# Altium project bluebox-micro-1B.PrjPCB
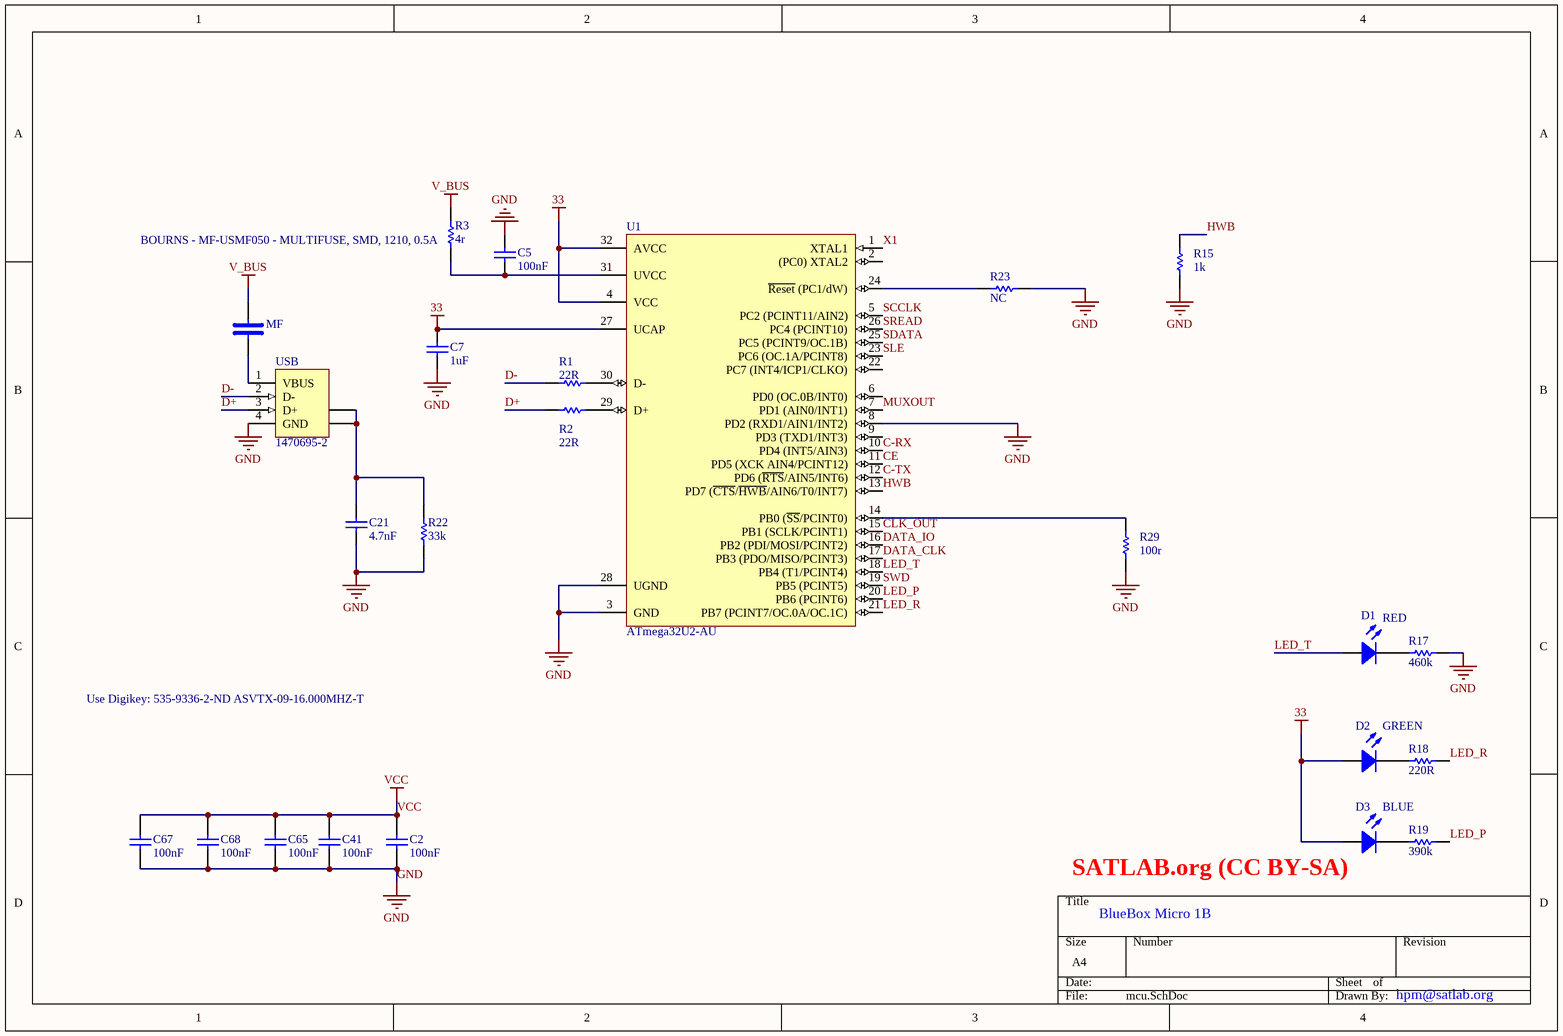
[diagram p0: mcu.SchDoc]
3 sheets, 94 parts. Net scope: global (net labels, ports and power ports of the same name join across sheets).
Board file: bluebox-micro-1B.PcbDoc
Sheets:
  mcu.SchDoc
  transceiver.SchDoc
  misc_rf.SchDoc

## Sheet mcu.SchDoc
size A4

### Parts
C2  value 100nF  [C06]  (hidden comment: Capacitor)
C5  value 100nF  [C06]  (hidden comment: Cap Semi)
C7  value 1uF  [C06]  (hidden comment: Cap Semi)
C21  value 4.7nF  [C06]  (hidden comment: Cap Semi)
C41  value 100nF  [C04]  (hidden comment: Capacitor)
C65  value 100nF  [C04]  (hidden comment: Capacitor)
C67  value 100nF  [C06]  (hidden comment: Capacitor)
C68  value 100nF  [C06]  (hidden comment: Capacitor)
D1  RED  [L06]
D2  GREEN  [L06]
D3  BLUE  [L06]
MF  CapacitorBig  [C1210]  (value not drawn)
R1  value 22R  [R06]  (hidden comment: Resistor)
R2  value 22R  [R06]  (hidden comment: Resistor)
R3  value 4r  [R06]  (hidden comment: Resistor)
R15  value 1k  [R06]  (hidden comment: Resistor)
R17  value 460k  [R06]  (hidden comment: Resistor)
R18  value 220R  [R06]  (hidden comment: Resistor)
R19  value 390k  [R06]  (hidden comment: Resistor)
R22  value 33k  [R06]  (hidden comment: Resistor)
R23  value NC  [R06]  (hidden comment: Resistor)
R29  value 100r  [R06]  (hidden comment: Resistor)
U1  ATmega32U2-AU  [32A_L]
USB  1470695-2  [1470695A]

### Nets
GND: C2.1 C5.1 C7.2 C21.2 C41.2 C65.2 C67.1 C68.1 R15.1 R17.1 R22.2 R23.1 R29.1 U1.3(GND) U1.8(PD2_(RXD1/AIN1/INT2)) U1.28(UGND) USB.4(GND)
V_BUS: MF.1 R3.1
VCC: C2.2 C7.1 C41.1 C65.1 C67.2 C68.2 D2.1(A) D3.1(A) U1.4(VCC) U1.27(UCAP) U1.32(AVCC)  [also labelled 33]
C-RX: U1.10(PD4_(INT5/AIN3))
C-TX: U1.12(PD6_(~{RTS}/AIN5/INT6))
CE: U1.11(PD5_(XCK_AIN4/PCINT12))
CLK_OUT: U1.15(PB1_(SCLK/PCINT1))
D+: R2.1 USB.3(D+)
D-: R1.2 USB.2(D-)
DATA_CLK: U1.17(PB3_(PDO/MISO/PCINT3))
DATA_IO: U1.16(PB2_(PDI/MOSI/PCINT2))
HWB: R15.2 U1.13(PD7_(~{CTS}/~{HWB}/AIN6/T0/INT7))
LED_P: R19.1 U1.20(PB6_(PCINT6))
LED_R: R18.1 U1.21(PB7_(PCINT7/OC.0A/OC.1C))
LED_T: D1.1(A) U1.18(PB4_(T1/PCINT4))
MUXOUT: U1.7(PD1_(AIN0/INT1))
SCCLK: U1.5(PC2_(PCINT11/AIN2))
SDATA: U1.25(PC5_(PCINT9/OC.1B))
SLE: U1.23(PC6_(OC.1A/PCINT8))
SREAD: U1.26(PC4_(PCINT10))
SWD: U1.19(PB5_(PCINT5))
X1: U1.1(XTAL1)
NetC5_2: C5.2 R3.2 U1.31(UVCC)
NetC21_1: C21.1 R22.1 USB.5(SHLD) USB.6(SHLD)
NetD1_2: D1.2(K) R17.2
NetD2_2: D2.2(K) R18.2
NetD3_2: D3.2(K) R19.2
NetMF_2: MF.2 USB.1(VBUS)
NetR1_1: R1.1 U1.30(D-)
NetR2_2: R2.2 U1.29(D+)
NetR23_2: R23.2 U1.24(~{Reset}_(PC1/dW))
NetR29_2: R29.2 U1.14(PB0_(~{SS}/PCINT0))

Not connected (* = marked no-connect by the designer): U1 2((PC0)_XTAL2) 6(PD0_(OC.0B/INT0)) 9(PD3_(TXD1/INT3)) 22(PC7_(INT4/ICP1/CLKO))

### Notes on the sheet
- (near R3) BOURNS - MF-USMF050 - MULTIFUSE, SMD, 1210, 0.5A
- Use Digikey: 535-9336-2-ND ASVTX-09-16.000MHZ-T
- (near D3) SATLAB.org (CC BY-SA)
- BlueBox Micro 1B
- hpm@satlab.org

### Library data of the parts
C2 C41 C65 C67 C68 = Capacitor: Capacitor, standard
C5 C7 C21 = Cap Semi: Capacitor (Semiconductor SIM Model); Published: 8-Jun-2000; LatestRevisionDate: 29-May-2009; LatestRevisionNote: IPC-7351 Footprint Added.; PackageReference: C1206; Publisher: Altium Limited; PackageDescription: Chip Capacitor
D1-D3 = LED: Typical RED GaAs LED; Published: 8-Jun-2000; LatestRevisionDate: 08-Jul-2005; LatestRevisionNote: Mech Layer 1 removed.; PackageReference: LED-1; Publisher: Altium Limited
MF = CapacitorBig: Capacitor for PRU etc.; By: Troels Jessen; Username: tjessen; Datasheet: http://search.murata.co.jp/Ceramy/image/img/w_hinm/L0005E.pdf; DigiKey: 490-5314-1-ND
R1-R3 R15 R17-R19 R22 R23 R29 = Resistor: By: Troels Jessen; Username: tjessen
U1 = ATmega32U2-AU: 8-bit AVR Microcontroller, 2.7-5.5V, 32KB Flash, 1KB EEPROM, 1KB SRAM, 32-pin TQFP, Industrial Grade (-40°C to 85°C); DatasheetVersion: revD, Nov-2010; PackageVersion: revC, Oct-2010; PackageReference: 32A; PackageDescription: 32-Lead, 7x7x1.0 mm Body, 0.8mm Lead Pitch, Thin Profile Plastic Quad Flat Package (TQFP); Code_JEDEC: MS-026-ABA; ComponentLink1Description: Manufacturer URL; ComponentLink1URL: http://www.atmel.com/; ComponentLink2Description: ATmega8U2/16U2/32U2 Datasheet; ComponentLink2URL: http://www.atmel.com/dyn/resources/prod_documents/doc7799.pdf; ComponentLink3Description: ATmega8U2/16U2/32U2 Summary; ComponentLink3URL: http://www.atmel.com/dyn/resources/prod_documents/7799S.pdf
USB = 1470695-2: USB 1.1, Right Angle, SMT, A Type, Plug, 4 Position, Natural; ContactMaterial: Brass; ContactPlating: Gold (30) over Nickel (50); PCB_Layout: Complies with manufacturer's recommendation.; DrillSize: Corresponds to nominal value.; PanelGround: Without; Published: 15-Jul-2004; DatasheetDocument: 21-Jan-2003; PackageDocument: 21-Jan-2003; PackageReference: 1470695A; Publisher: Altium Limited; HousingMaterial: Thermoplastic; ComponentLink1Description: Manufacturer Link; ComponentLink1URL: http://www.tycoelectronics.com/; ComponentLink2Description: Packaging Specification; ComponentLink2URL: http://ecommas.tycoelectronics.com/commerce/DocumentDelivery/DDEController?Action=showdoc&DocId=Customer+Drawing%7F1470695%7FO%7Fpdf%7FEnglish%7FC_1470695_O.pdf

## Sheet transceiver.SchDoc
size A3
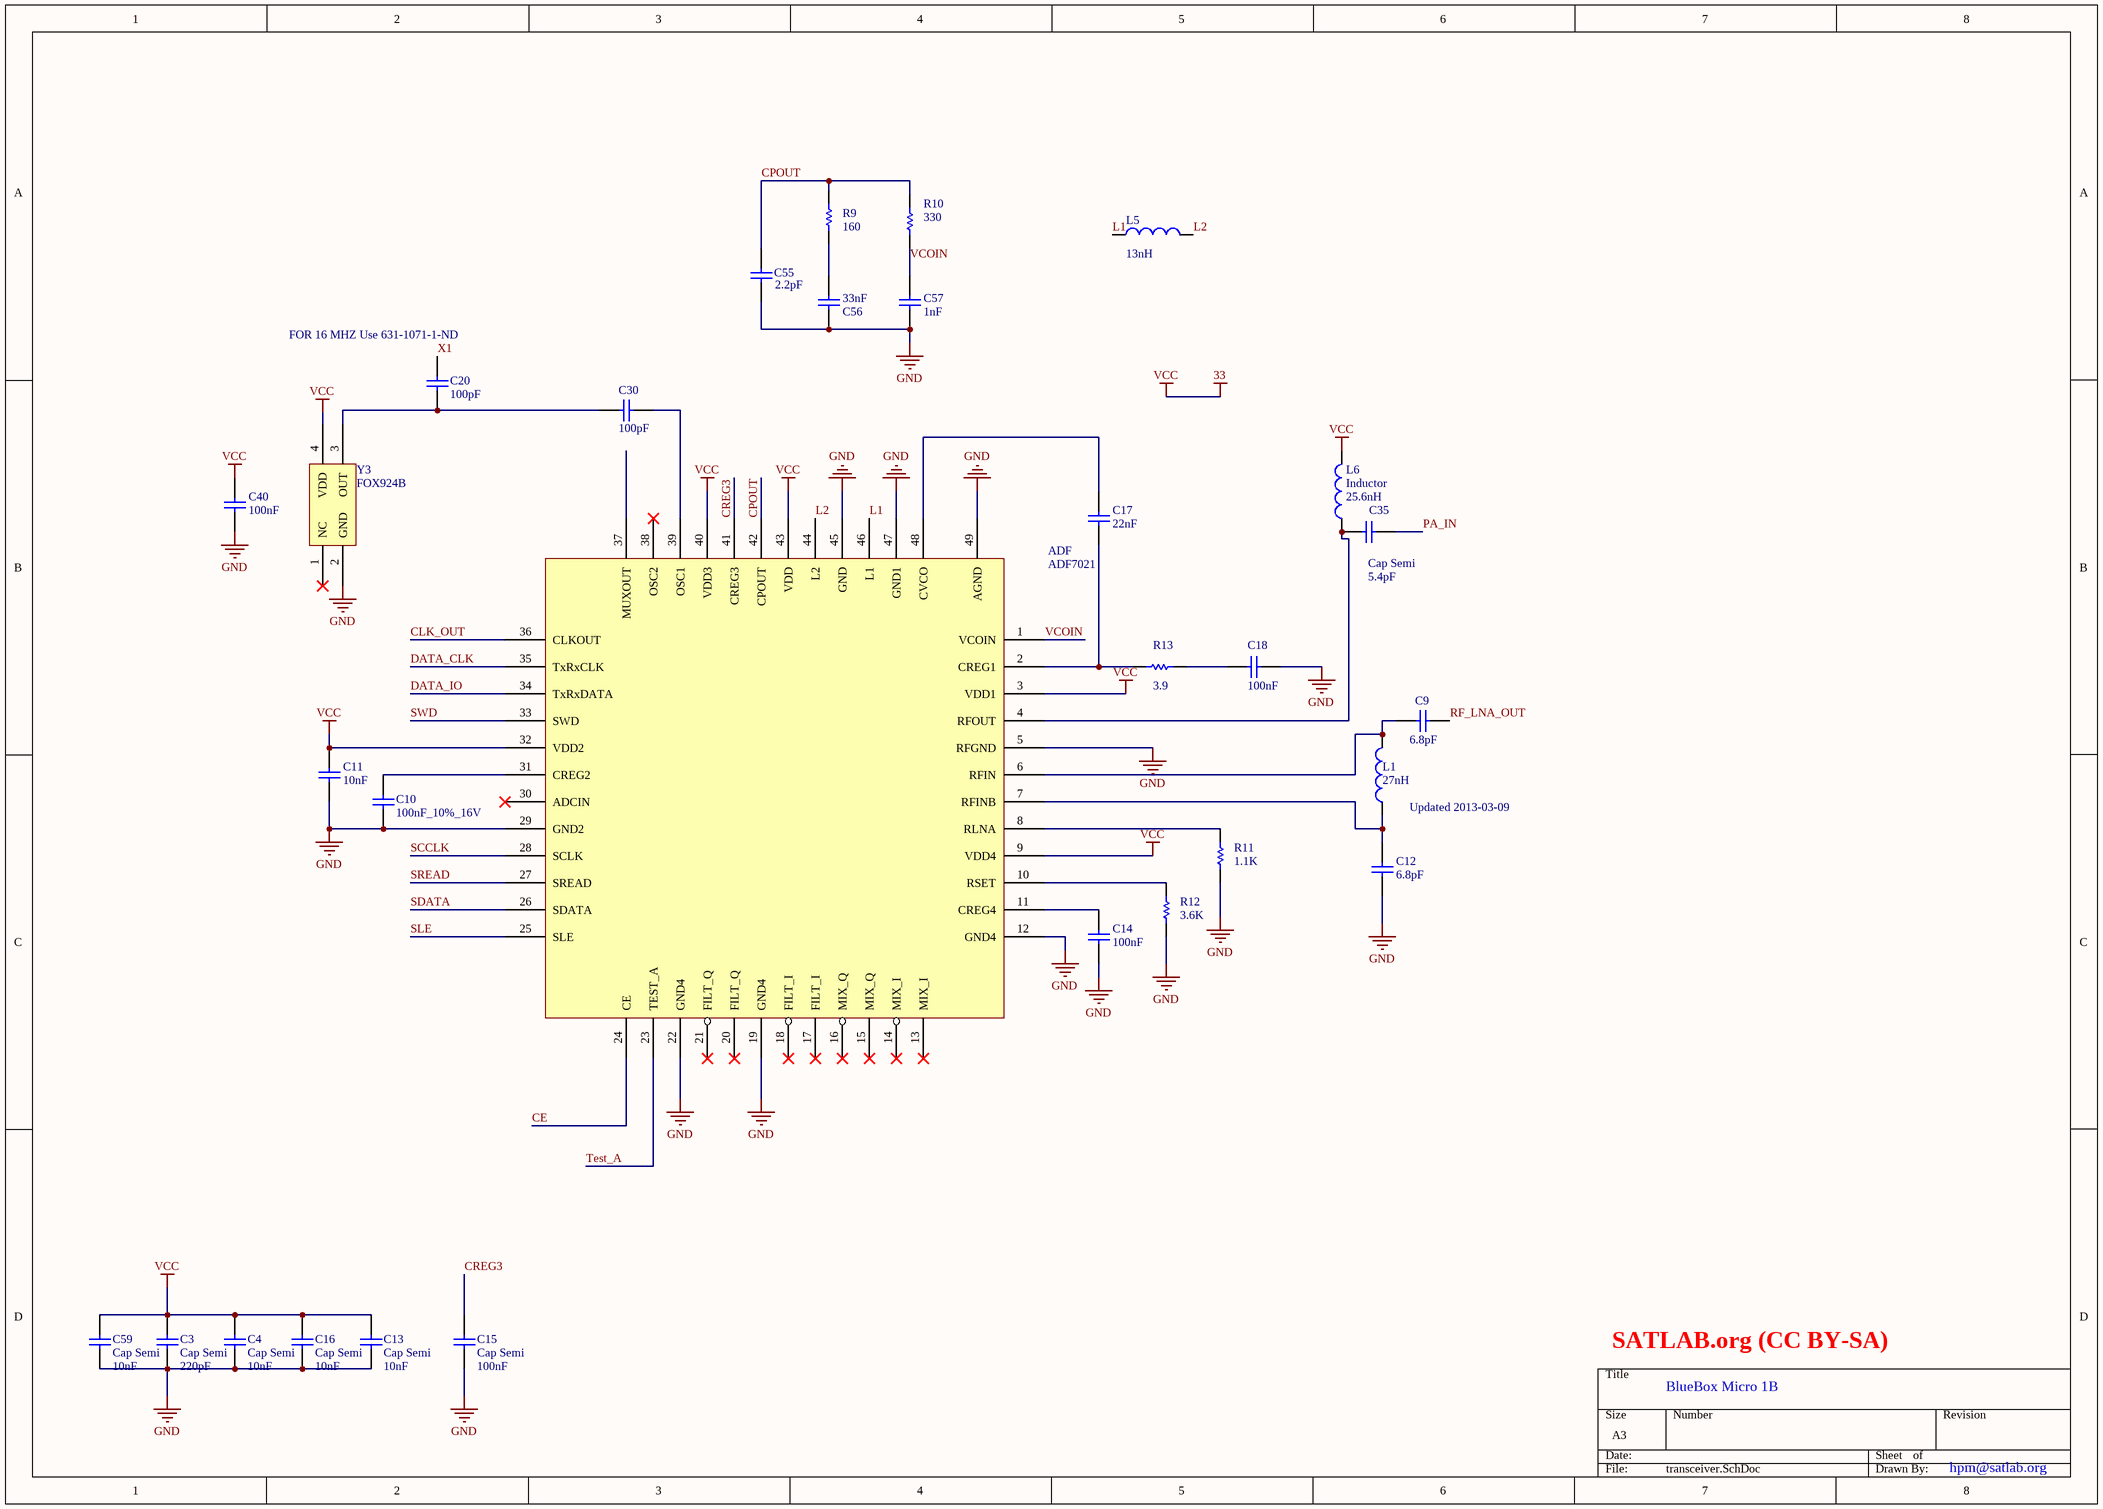
[diagram p1: transceiver.SchDoc]

### Parts
ADF  ADF7021  [QFN50P700X700X100-48M]
C3  Cap Semi  value 220pF  [C06]
C4  Cap Semi  value 10nF  [C06]
C9  value 6.8pF  [C06]  (hidden comment: Cap Semi)
C10  value 100nF_10%_16V  [C04]  (hidden comment: Capacitor)
C11  value 10nF  [C06]  (hidden comment: Cap Semi)
C12  value 6.8pF  [C06]  (hidden comment: Cap Semi)
C13  Cap Semi  value 10nF  [C06]
C14  value 100nF  [C06]  (hidden comment: Cap Semi)
C15  Cap Semi  value 100nF  [C06]
C16  Cap Semi  value 10nF  [C06]
C17  value 22nF  [C06]  (hidden comment: Cap Semi)
C18  value 100nF  [C06]  (hidden comment: Cap Semi)
C20  value 100pF  [C04]  (hidden comment: Capacitor)
C30  value 100pF  [C04]  (hidden comment: Capacitor)
C35  Cap Semi  value 5.4pF  [C06]
C40  value 100nF  [C06]  (hidden comment: Cap Semi)
C55  value 2.2pF  [C06]  (hidden comment: Cap Semi)
C56  value 33nF  [C06]  (hidden comment: Cap Semi)
C57  value 1nF  [C06]  (hidden comment: Cap Semi)
C59  Cap Semi  value 10nF  [C06]
L1  value 27nH  [C06]  (hidden comment: Inductor)
L5  value 13nH  [L06]  (hidden comment: Inductor)
L6  Inductor  value 25.6nH  [C06]
R9  value 160  [R06]  (hidden comment: Res Semi)
R10  value 330  [R06]  (hidden comment: Res Semi)
R11  value 1.1K  [R06]  (hidden comment: Res Semi)
R12  value 3.6K  [R06]  (hidden comment: Res Semi)
R13  value 3.9  [R06]  (hidden comment: Res Semi)
Y3  FOX924B  [Fox924]

### Nets
GND: ADF.5(RFGND) ADF.12(GND4) ADF.19(GND4) ADF.22(GND4) ADF.29(GND2) ADF.45(GND) ADF.47(GND1) ADF.49(AGND) C3.1 C4.1 C10.1 C11.1 C12.1 C13.1 C14.1 C15.1 C16.1 C18.2 C40.1 C55.1 C56.1 C57.1 C59.1 R11.2 R12.1 Y3.2(GND)
VCC: ADF.3(VDD1) ADF.9(VDD4) ADF.32(VDD2) ADF.40(VDD3) ADF.43(VDD) C3.2 C4.2 C11.2 C13.2 C16.2 C40.2 C59.2 L6.2 Y3.4(VDD)  [also labelled 33]
CE: ADF.24(CE)
CLK_OUT: ADF.36(CLKOUT)
CPOUT: ADF.42(CPOUT) C55.2 R9.2 R10.2
CREG3: ADF.41(CREG3) C15.2
DATA_CLK: ADF.35(TxRxCLK)
DATA_IO: ADF.34(TxRxDATA)
L1: ADF.46(L1) L5.1
L2: ADF.44(L2) L5.2
PA_IN: C35.2
RF_LNA_OUT: C9.1
SCCLK: ADF.28(SCLK)
SDATA: ADF.26(SDATA)
SLE: ADF.25(SLE)
SREAD: ADF.27(SREAD)
SWD: ADF.33(SWD)
Test_A: ADF.23(TEST_A)
VCOIN: ADF.1(VCOIN) C57.2 R10.1
X1: C20.1
NetADF_2: ADF.2(CREG1) C17.1 R13.1
NetADF_4: ADF.4(RFOUT) C35.1 L6.1
NetADF_6: ADF.6(RFIN) C9.2 L1.2
NetADF_7: ADF.7(RFINB) C12.2 L1.1
NetADF_8: ADF.8(RLNA) R11.1
NetADF_10: ADF.10(RSET) R12.2
NetADF_11: ADF.11(CREG4) C14.2
NetADF_31: ADF.31(CREG2) C10.2
NetADF_39: ADF.39(OSC1) C30.1
NetADF_48: ADF.48(CVCO) C17.2
NetC18_1: C18.1 R13.2
NetC20_2: C20.2 C30.2 Y3.3(OUT)
NetC56_2: C56.2 R9.1

Not connected (* = marked no-connect by the designer): ADF 13(MIX_I)* 14(MIX_I)* 15(MIX_Q)* 16(MIX_Q)* 17(FILT_I)* 18(FILT_I)* 20(FILT_Q)* 21(FILT_Q)* 30(ADCIN)* 37(MUXOUT) 38(OSC2)*; Y3 1(NC)*

### Notes on the sheet
- Using http://www.calculatoredge.com/electronics/ch%20pi%20low%20pass.htm
- (near C20) FOR 16 MHZ Use 631-1071-1-ND
- Using http://bwrc.eecs.berkeley.edu/research/rf/projects/60ghz/matching/impmatch.html
- (near L1) Updated 2013-03-09
- SATLAB.org (CC BY-SA)
- BlueBox Micro 1B
- hpm@satlab.org

### Library data of the parts
ADF = ADF7021: ADF7021 transceiver; By: Nikolaj Bisgaard Pedersen; Datasheet: http://www.analog.com/static/imported-files/data_sheets/ADF7021.pdf; Homepage: http://www.analog.com/en/rfif-components/short-range-transceivers/adf7021/products/product.html; Supplier 1: Digi-Key; Supplier Part Number 1: ADF7021BCPZ-ND
C3 C4 C9 C11-C18 C35 C40 C55-C57 C59 = Cap Semi: Capacitor (Semiconductor SIM Model); Published: 8-Jun-2000; LatestRevisionDate: 17-Jul-2002; LatestRevisionNote: Re-released for DXP Platform.; PackageReference: C1206; Publisher: Altium Limited
C10 C20 C30 = Capacitor: Capacitor, standard
L5 = Inductor: Code_IEC: 1005; Published: 8-Jun-2000; LatestRevisionDate: 29-May-2009; LatestRevisionNote: IPC-7351 Footprint Added.; PackageReference: 0402-A; Publisher: Altium Limited; PackageDescription: Chip Inductor; Code_JEITA: 0402
R9-R13 = Res Semi: Semiconductor Resistor; Published: 8-Jun-2000; LatestRevisionDate: 17-Jul-2002; LatestRevisionNote: Re-released for DXP Platform.; PackageReference: AXIAL-0.5; Publisher: Altium Limited
Y3 = FOX924B: FOX924B TCXO 19.44 MHz; By: Nikolaj B. Pedersen; Username: Markem; Datasheet: http://www.foxonline.com/pdfs/fox924.pdf; Digikey: 631-1072-1-ND; Supplier 1: Digi-Key; Supplier 2: Farnell; Supplier Part Number 1: 631-1072-1-ND; Supplier Part Number 2: 2063960
L1 L6 = Inductor: Published: 07-04-2008; LatestRevisionNote: Aalborg University; PackageReference: 0402-A; Publisher: <HP>; Digikey: 495-2017-1-ND

## Sheet misc_rf.SchDoc
size A4
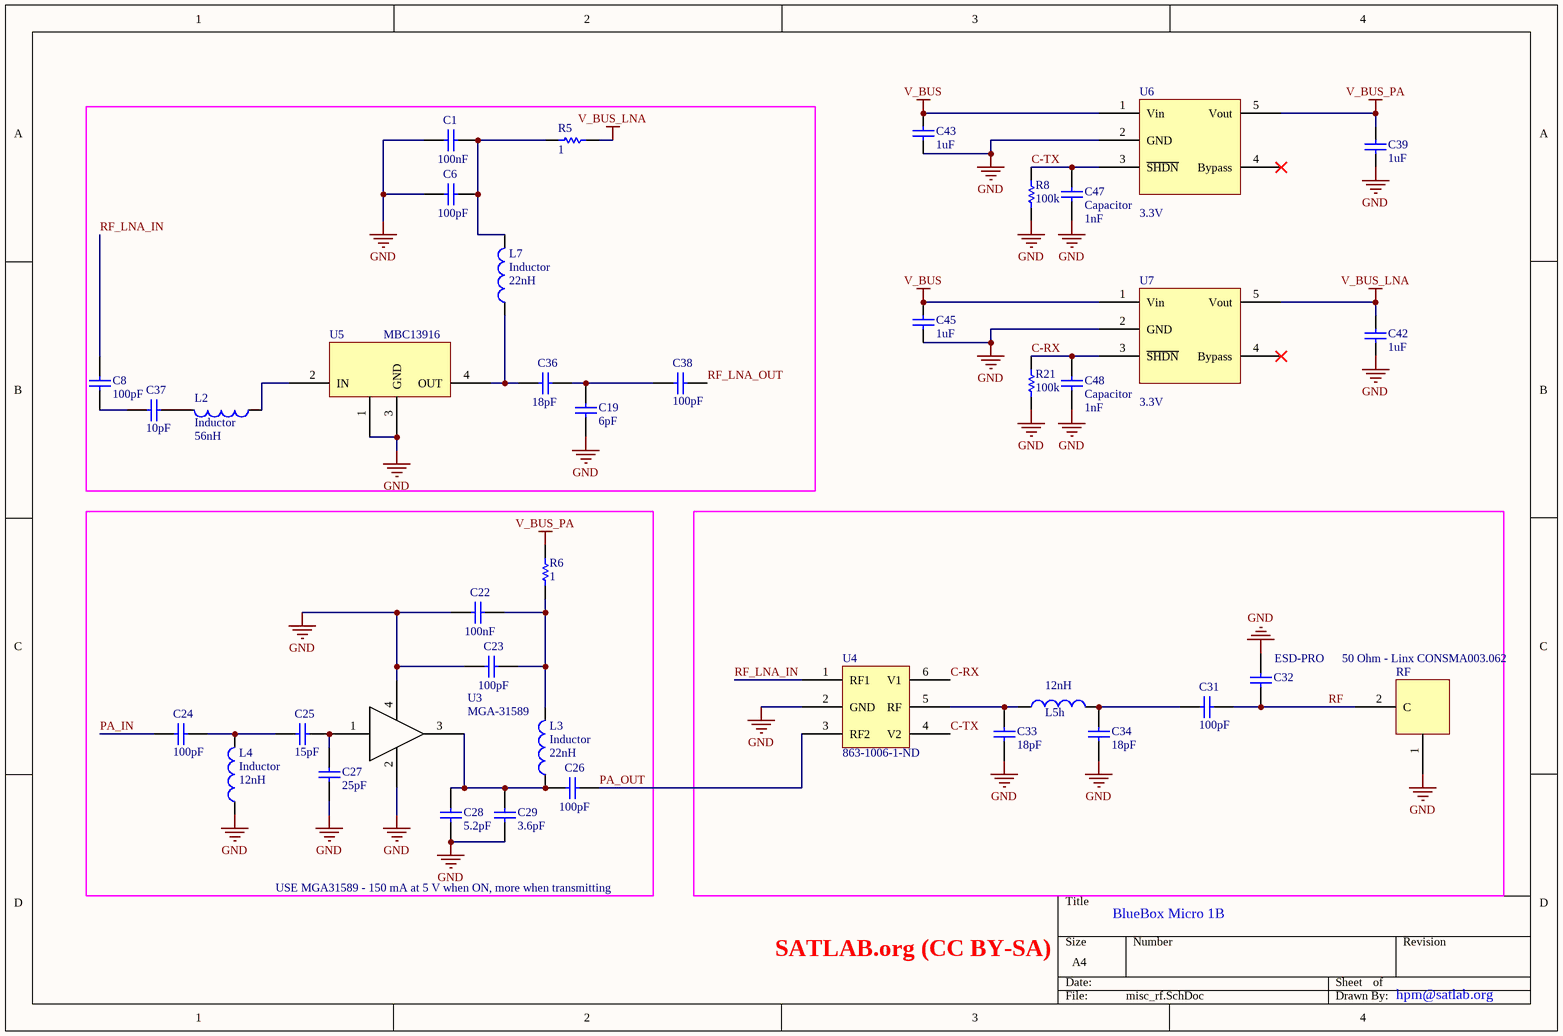
[diagram p2: misc_rf.SchDoc]

### Parts
C1  value 100nF  [C06]  (hidden comment: Cap Semi)
C6  value 100pF  [C06]  (hidden comment: Cap Semi)
C8  value 100pF  [C06]  (hidden comment: Cap Semi)
C19  value 6pF  [C06]  (hidden comment: Cap Semi)
C22  value 100nF  [C06]  (hidden comment: Cap Semi)
C23  value 100pF  [C06]  (hidden comment: Cap Semi)
C24  value 100pF  [C06]  (hidden comment: Cap Semi)
C25  value 15pF  [C06]  (hidden comment: Cap Semi)
C26  value 100pF  [C06]  (hidden comment: Cap Semi)
C27  value 25pF  [C06]  (hidden comment: Cap Semi)
C28  value 5.2pF  [C06]  (hidden comment: Cap Semi)
C29  value 3.6pF  [C06]  (hidden comment: Cap Semi)
C31  value 100pF  [C06]  (hidden comment: Capacitor)
C32  value ESD-PRO  [C06]  (hidden comment: Capacitor)
C33  value 18pF  [C06]  (hidden comment: Cap Semi)
C34  value 18pF  [C06]  (hidden comment: Cap Semi)
C36  value 18pF  [C06]  (hidden comment: Cap Semi)
C37  value 10pF  [C06]  (hidden comment: Cap Semi)
C38  value 100pF  [C06]  (hidden comment: Cap Semi)
C39  value 1uF  [C06]  (hidden comment: Capacitor)
C42  value 1uF  [C06]  (hidden comment: Capacitor)
C43  value 1uF  [C06]  (hidden comment: Capacitor)
C45  value 1uF  [C06]  (hidden comment: Capacitor)
C47  Capacitor  value 1nF  [C06]
C48  Capacitor  value 1nF  [C06]
L2  Inductor  value 56nH  [C06]
L3  Inductor  value 22nH  [C06]
L4  Inductor  value 12nH  [C06]
L5h  value 12nH  [C06]  (hidden comment: Inductor)
L7  Inductor  value 22nH  [C06]
R5  value 1  [R06]  (hidden comment: Resistor)
R6  value 1  [R06]  (hidden comment: Resistor)
R8  value 100k  [R06]  (hidden comment: Resistor)
R21  value 100k  [R06]  (hidden comment: Resistor)
RF  50 Ohm - Linx CONSMA003.062  [sma-egde]
U3  MGA-31589  [SOT-223B-small]
U4  Supplier Part Number 1: 863-1006-1-ND  [SOT95P280X145-6N]  (hidden comment: AS193-73)
U5  MBC13916  [MBC13916]
U6  Voltage: 3.3V  [SOT23]
U7  Voltage: 3.3V  [SOT23]

### Blocks framed on the sheet
USE MGA31589 - 150 mA at 5 V when ON, more when transmitting: C22-C29 L3 L4 R6 U3

### Nets
GND: C1.2 C6.2 C19.2 C22.2 C23.2 C27.1 C28.2 C29.2 C32.1 C33.2 C34.2 C39.1 C42.1 C43.1 C45.1 C47.2 C48.2 L4.1 R8.1 R21.1 RF.1(GND) U3.2(GND) U3.4(GND) U4.2(GND) U5.1(GND) U5.3(GND) U6.2(GND) U7.2(GND)
V_BUS: C43.2 C45.2 U6.1(Vin) U7.1(Vin)
V_BUS_LNA: C42.2 R5.2 U7.5(Vout)
V_BUS_PA: C39.2 R6.2 U6.5(Vout)
C-RX: C48.1 R21.2 U4.6(V1) U7.3(~{SHDN})
C-TX: C47.1 R8.2 U4.4(V2) U6.3(~{SHDN})
PA_IN: C24.1
PA_OUT: C26.1 U4.3(RF2)
RF: C31.1 C32.2 RF.2(C)
RF_LNA_IN: C8.1 U4.1(RF1)
RF_LNA_OUT: C38.2
NetC1_1: C1.1 C6.1 L7.2 R5.1
NetC8_2: C8.2 C37.1
NetC19_1: C19.1 C36.1 C38.1
NetC22_1: C22.1 C23.1 L3.2 R6.1
NetC24_2: C24.2 C25.1 L4.2
NetC25_2: C25.2 C27.2 U3.1(RF_IN)
NetC26_2: C26.2 C28.1 C29.1 L3.1 U3.3(RF_OUT)
NetC31_2: C31.2 C34.1 L5h.2
NetC33_1: C33.1 L5h.1 U4.5(RF)
NetC36_2: C36.2 L7.1 U5.4(OUT)
NetC37_2: C37.2 L2.2
NetL2_1: L2.1 U5.2(IN)

Not connected (* = marked no-connect by the designer): U6 4(Bypass)*; U7 4(Bypass)*

### Notes on the sheet
- BlueBox Micro 1B
- SATLAB.org (CC BY-SA)
- hpm@satlab.org

### Library data of the parts
C1 C6 C8 C19 C22-C29 C33 C34 C36-C38 = Cap Semi: Capacitor (Semiconductor SIM Model); Published: 8-Jun-2000; LatestRevisionDate: 17-Jul-2002; LatestRevisionNote: Re-released for DXP Platform.; PackageReference: C1206; Publisher: Altium Limited
C31 C32 C39 C42 C43 C45 C47 C48 = Capacitor: Capacitor, standard
R5 R6 R8 R21 = Resistor: By: Troels Jessen; Username: tjessen
RF = SMA_BOARD_EGDE: Linx CONSMA003.062  -  SMA Female Edge Mount for 1.6 mm PCB
U3 = MGA-31589: 0.5 W High Gain Driver Amplifier
U4 = AS193-73: PHEMT GaAs IC High-Linearity 3 V  Control SPDT Switch 0.1–2.5 GHz; By: HP; Datasheet: http://www.skyworksinc.com/uploads/documents/200186C.pdf; DigiKey: 863-1006-1-ND; Supplier 1: Digi-Key
U6 U7 = TC1185: Voltage regulater from Microchip
L2-L4 L5h L7 = Inductor: Published: 07-04-2008; LatestRevisionNote: Aalborg University; PackageReference: 0402-A; Publisher: <HP>; Digikey: 495-2017-1-ND

## Nets that join several sheets
GND: mcu (17 pins), transceiver (26 pins), misc_rf (28 pins)
V_BUS: mcu (MF.1 R3.1), misc_rf (C43.2 C45.2 U6.1 U7.1)
VCC: mcu (11 pins), transceiver (14 pins)
C-RX: mcu (U1.10), misc_rf (C48.1 R21.2 U4.6 U7.3)
C-TX: mcu (U1.12), misc_rf (C47.1 R8.2 U4.4 U6.3)
CE: mcu (U1.11), transceiver (ADF.24)
CLK_OUT: mcu (U1.15), transceiver (ADF.36)
DATA_CLK: mcu (U1.17), transceiver (ADF.35)
DATA_IO: mcu (U1.16), transceiver (ADF.34)
PA_IN: transceiver (C35.2), misc_rf (C24.1)
RF_LNA_OUT: transceiver (C9.1), misc_rf (C38.2)
SCCLK: mcu (U1.5), transceiver (ADF.28)
SDATA: mcu (U1.25), transceiver (ADF.26)
SLE: mcu (U1.23), transceiver (ADF.25)
SREAD: mcu (U1.26), transceiver (ADF.27)
SWD: mcu (U1.19), transceiver (ADF.33)
X1: mcu (U1.1), transceiver (C20.1)